# EAGLE design splitPowerSupply (EAGLE 8.7.0)
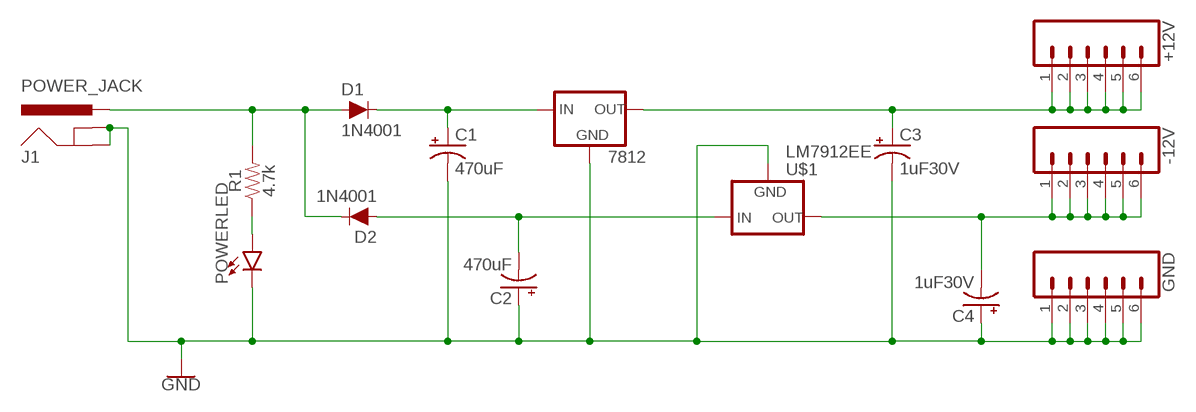
[diagram p0: schematic, sheet 1]

## Parts
7812  V_REG_78XX-TO-220  [TO-220-ALT]
+12V  CONN_06LONGPADS  [1X06_LONGPADS]
-12V  CONN_06LONGPADS  [1X06_LONGPADS]
C1  470uF  10UF-POLAR-RADIAL-2.5MM-25V-20%  [CPOL-RADIAL-2.5MM-5MM]
C2  470uF  10UF-POLAR-RADIAL-2.5MM-25V-20%  [CPOL-RADIAL-2.5MM-5MM]
C3  1uF30V  10UF-POLAR-RADIAL-2.5MM-25V-20%  [CPOL-RADIAL-2.5MM-5MM]
C4  1uF30V  10UF-POLAR-RADIAL-2.5MM-25V-20%  [CPOL-RADIAL-2.5MM-5MM]
D1  1N4001  DIODE-PTH  [DIODE-1N4001]
D2  1N4001  DIODE-PTH  [DIODE-1N4001]
GND  CONN_06LONGPADS  [1X06_LONGPADS]
J1  POWER_JACK  [POWER_JACK_PTH]
POWERLED  LED-3MM-NO_SILK  [LED_3MM-NS]
R1  4.7k  1KOHM-HORIZ-1/4W-1%  [AXIAL-0.3]
U$1  LM7912EE  V_REG_79XX  [79XXL]

## Nets
GND: 7812.GND C1.2(-) C2.1(+) C3.2(-) C4.1(+) GND.1 GND.2 GND.3 GND.4 GND.5 GND.6 J1.GND J1.GNDBREAK POWERLED.K(C) U$1.GND
N$1: D1.A D2.C J1.PWR R1.P$2
N$2: POWERLED.A R1.P$1
N$3: C2.2(-) D2.A U$1.IN
N$4: 7812.IN C1.1(+) D1.C
N$5: 7812.OUT +12V.1 +12V.2 +12V.3 +12V.4 +12V.5 +12V.6 C3.1(+)
N$6: -12V.1 -12V.2 -12V.3 -12V.4 -12V.5 -12V.6 C4.2(-) U$1.OUT

## Library data of the parts
7812 = SparkFun-IC-Power:V_REG_78XX: Voltage Regulator Standard 78xx regulator. IGO (Input Ground Output). Spark Fun Electronics SKU : COM-00107; PROD_ID: VREG-08450; SF_ID: COM-00107
+12V -12V GND = SparkFun-Connectors:CONN_06: Multi connection point. Often used as Generic Header-pin footprint for 0.1 inch spaced/style header connections On any of the 0.1 inch spaced packages, you can populate with these: Break Away Headers - Straight <https://www.sparkfun.com/products/116> (PRT-00116) Break Away Male Headers - Right Angle <https://www.sparkfun.com/products/553> (PRT-00553) Female Headers <https://www.sparkfun.com/products/115> (PRT-00115) Break Away Headers - Machine Pin <https://www.sparkfun.com/products/117> (PRT-00117) Break Away Female Headers - Swiss Machine Pin <https://www.sparkfun.com/products/743> (PRT-00743) Arduino Stackable Header - 6 Pin <https://www.sparkfun.com/products/9280> (PRT-09280) For SCREWTERMINALS and SPRING TERMINALS visit here: Screw Terimnals on SparkFun.com <https://www.sparkfun.com/search/results?term=Screw+Terminals> (5mm/3.5mm/2.54mm spacing) This device is also useful as a general connection point to wire up your design to another part of your project. Our various solder wires solder well into these plated through hole pads. Hook-Up Wire - Assortment (Stranded, 22 AWG) <https://www.sparkfun.com/products/11375> (PRT-11375) Hook-Up Wire - Assortment (Solid Core, 22 AWG) <https://www.sparkfun.com/products/11367> (PRT-11367) View the entire wire category on our website here <https://www.sparkfun.com/categories/141>
C1-C4 = SparkFun-Capacitors:10UF-POLAR: 10.0µF polarized capacitors A capacitor is a passive two-terminal electrical component used to store electrical energy temporarily in an electric field.; PROD_ID: CAP-08440; VALUE: 10uF
D1 D2 = SparkFun-DiscreteSemi:DIODE: Diode These are standard reverse protection diodes and small signal diodes. SparkFun Products: SparkFun SparkPunk Sound Kit <https://www.sparkfun.com/products/11177> SparkFun ESP8266 Thing <https://www.sparkfun.com/products/13231>; PROD_ID: DIO-09176; VALUE: 1A/50V/1.1V
J1 = SparkFun-Connectors:POWER_JACK: Power Jack Connector This is the standard 5.5mm barrel jack for power. The PTH is the most common, proven, reliable, footprint. The Slot footprint only works if the mill layer is transmitted to the PCB fab house so be warned. Here are the connectors we sell at SparkFun: DC Barrel Power Jack/Connector <https://www.sparkfun.com/products/119> (PRT-00119) DC Barrel Power Jack/Connector (SMD) <https://www.sparkfun.com/products/12748> (PRT-12748) DC Barrel Jack Adapter - Breadboard Compatible <https://www.sparkfun.com/products/10811> (PRT-10811) It is used on this SparkFun product (and many, many others): SparkFun RedBoard - Programmed with Arduino <https://www.sparkfun.com/products/12757> (DEV-12757) Also, if you need a mating power supply or connector, please check these out: Wall Adapter Power Supply - 9VDC 650mA <https://www.sparkfun.com/products/298> (TOL-00298) DC Barrel Jack Adapter - Male <https://www.sparkfun.com/products/10287> (PRT-10287); PROD_ID: CONN-08197
POWERLED = SparkFun-LED:LED: LED (Generic) Standard schematic elements and footprints for 5mm, 3mm, 1206, and 0603 sized LEDs. Generic LEDs with no color specified.
R1 = SparkFun-Resistors:1KOHM: 1kΩ resistor A resistor is a passive two-terminal electrical component that implements electrical resistance as a circuit element. Resistors act to reduce current flow, and, at the same time, act to lower voltage levels within circuits. - Wikipedia; PROD_ID: RES-12182; VALUE: 1k
U$1 = SparkFun-IC-Power:V_REG_79XX

## Net classes
0 default: clearance 0.762 mm

## Board
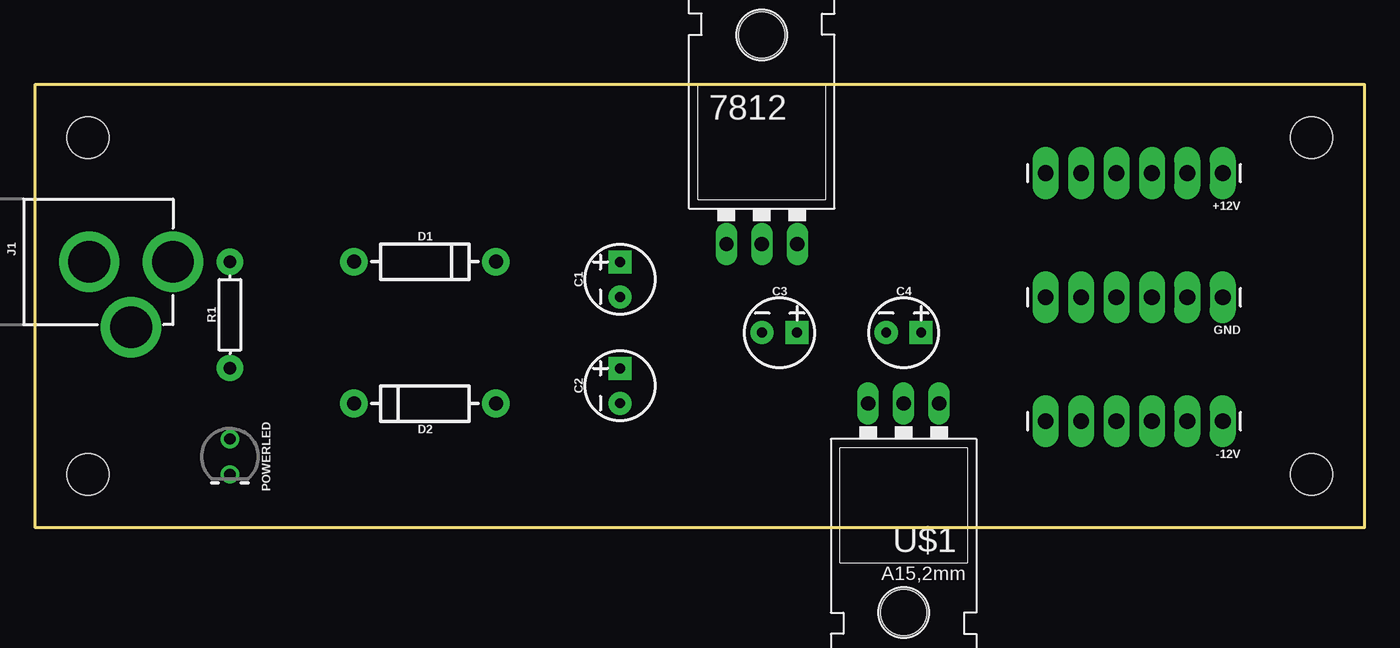
[diagram p1: board, top side]
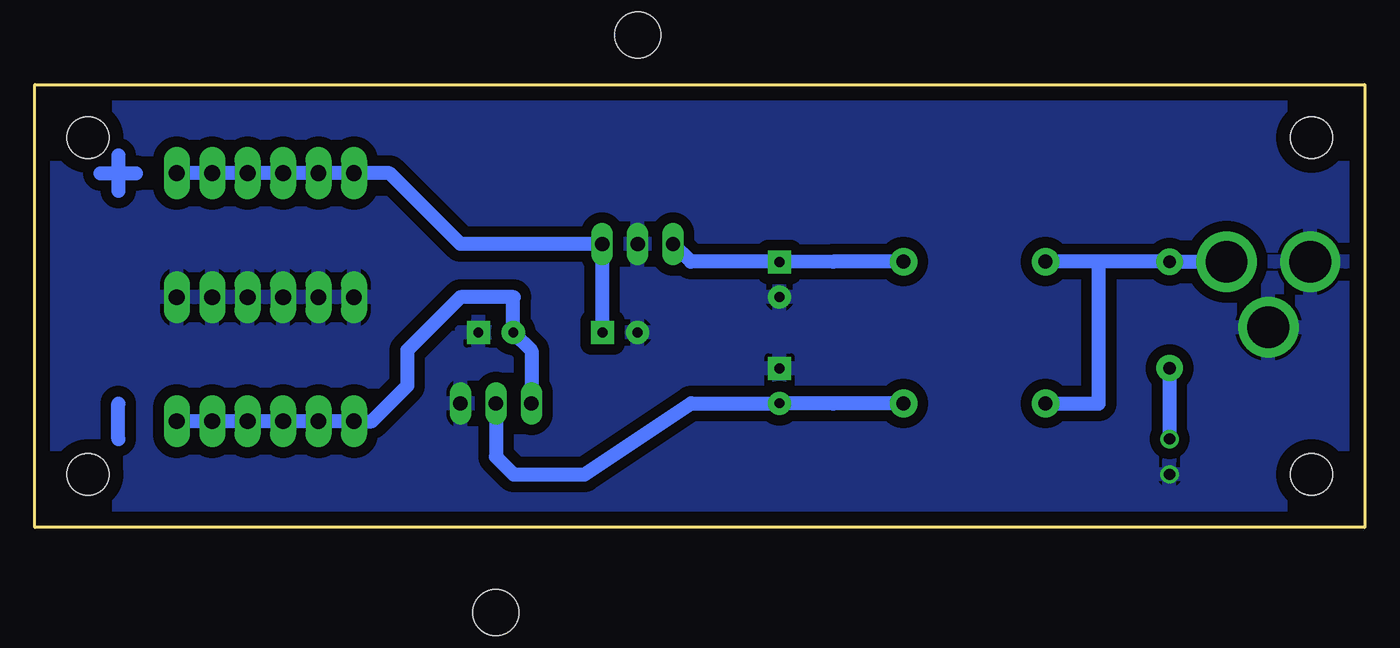
[diagram p2: board, bottom side, seen from below]

Size 95.25 x 31.75 mm. Coordinates in mm from the lower left corner, seen from the top.
Outline: 0,31.75 0,0 95.25,0 95.25,31.75 0,31.75
Copper layers (1*16): Top 0.035mm / dielectric 1.5mm / Bottom 0.035mm
Design rules "default": minimum track width 6mil, minimum drill 0.35mm, track to track 6mil, track to pad 6mil, pad to pad 6mil, via to via 6mil, smd to smd 6mil, copper to edge 40mil, drill to drill 6mil, minimum pad ring 10mil, minimum via ring 8mil, stop-mask expansion 4mil, vias tented up to drill 0mil, thermal gap 10mil
Holes 3 mm at 3.81,3.81 3.81,27.94 91.44,3.81 91.44,27.94

### Footprints (pad centres in the part's own frame; a part is rotated, then mirrored left to right if it is on the bottom)
TO-220-ALT = drill 1.016 long: GND 0,-3.81; IN -2.54,-3.81; OUT 2.54,-3.81 | hole 3.302: 0,11.176
1X06_LONGPADS = drill 1.118 pad 1.88 long: 1 0,0; 2 2.54,0; 3 5.08,0; 4 7.62,0; 5 10.16,0; 6 12.7,0
CPOL-RADIAL-2.5MM-5MM = drill 0.7 pad 1.651 square: 1 1.25,0 | drill 0.7 pad 1.651: 2 -1.25,0
DIODE-1N4001 = drill 1 pad 1.981: A -5.08,0; C 5.08,0
POWER_JACK_PTH = drill 2.997 pad 4.318: GND 0,7.7; GNDBREAK 4.7,10.7; PWR 0,13.7
LED_3MM-NS = drill 0.813: A -1.27,0; K 1.27,0
AXIAL-0.3 = drill 0.9 pad 1.88: P$1 -3.81,0; P$2 3.81,0
79XXL = drill 1.016 long: GND -2.54,-7.62; IN 0,-7.62; OUT 2.54,-7.62 | hole 3.302: 0,7.366

### Placement (x,y rotation side)
7812  52.07,24.13 0 top
+12V  85.09,25.4 180 top
-12V  85.09,7.62 180 top
C1  41.91,17.78 90 top
C2  41.91,10.16 90 top
C3  53.34,13.97 0 top
C4  62.23,13.97 0 top
D1  27.94,19.05 0 top
D2  27.94,8.89 180 top
GND  85.09,16.51 180 top
J1  -3.81,19.05 270 top
POWERLED  13.97,5.08 270 top
R1  13.97,15.24 90 top
U$1  62.23,1.27 180 top

### Tracks (layer width: path | path; a pad name or v marks a point on that pad's centre or on a via)
GND
  pour Bottom: 0,31.75 0,0 95.25,0 95.25,31.75
N$1
  Bottom 1.016: 19.05,19.05 R1.P$2 J1.PWR | 19.05,19.05 D1.A | D2.C 19.05,8.89 19.05,19.05
N$2
  Bottom 1.016: R1.P$1 POWERLED.A
N$3
  Bottom 1.016: U$1.IN 62.23,5.08 60.96,3.81 55.88,3.81 48.24,8.91 C2.2 38.08,8.89 D2.A
N$4
  Bottom 1.016: D1.C 38.08,19.05 C1.1 41.93,19.05 48.26,19.05 7812.IN
N$5
  Bottom 1.016: C3.1 54.61,13.99 7812.OUT 64.77,20.32 69.85,25.4 +12V.6 +12V.5 +12V.4 +12V.3 +12V.2 +12V.1
N$6
  Bottom 1.016: U$1.OUT 59.69,12.68 C4.2 60.98,16.49 60.96,16.51 64.77,16.51 68.58,12.7 68.58,10.16 71.12,7.62 -12V.6 -12V.5 -12V.4 -12V.3 -12V.2 -12V.1
N$7
  Bottom 1.016: 89.28,6.35 89.28,8.89
N$8
  Bottom 1.016: 89.28,26.67 89.28,24.13
N$9
  Bottom 1.016: 90.55,25.4 88.01,25.4